# EAGLE design TimearcSides (EAGLE 6.5.0)
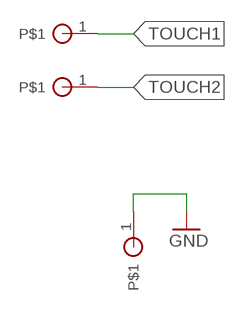
[diagram p0: schematic, sheet 1]

## Parts
TOUCH1  SOLDER_PAD  [SOLDER_PAD]
TOUCH2  SOLDER_PAD  [SOLDER_PAD]
U$3  SOLDER_PAD  [SOLDER_PAD]

## Nets
GND: U$3.1
TOUCH1: TOUCH1.1
TOUCH2: TOUCH2.1

## Library data of the parts
TOUCH1 TOUCH2 U$3 = timearc:SOLDER_PAD

## Board
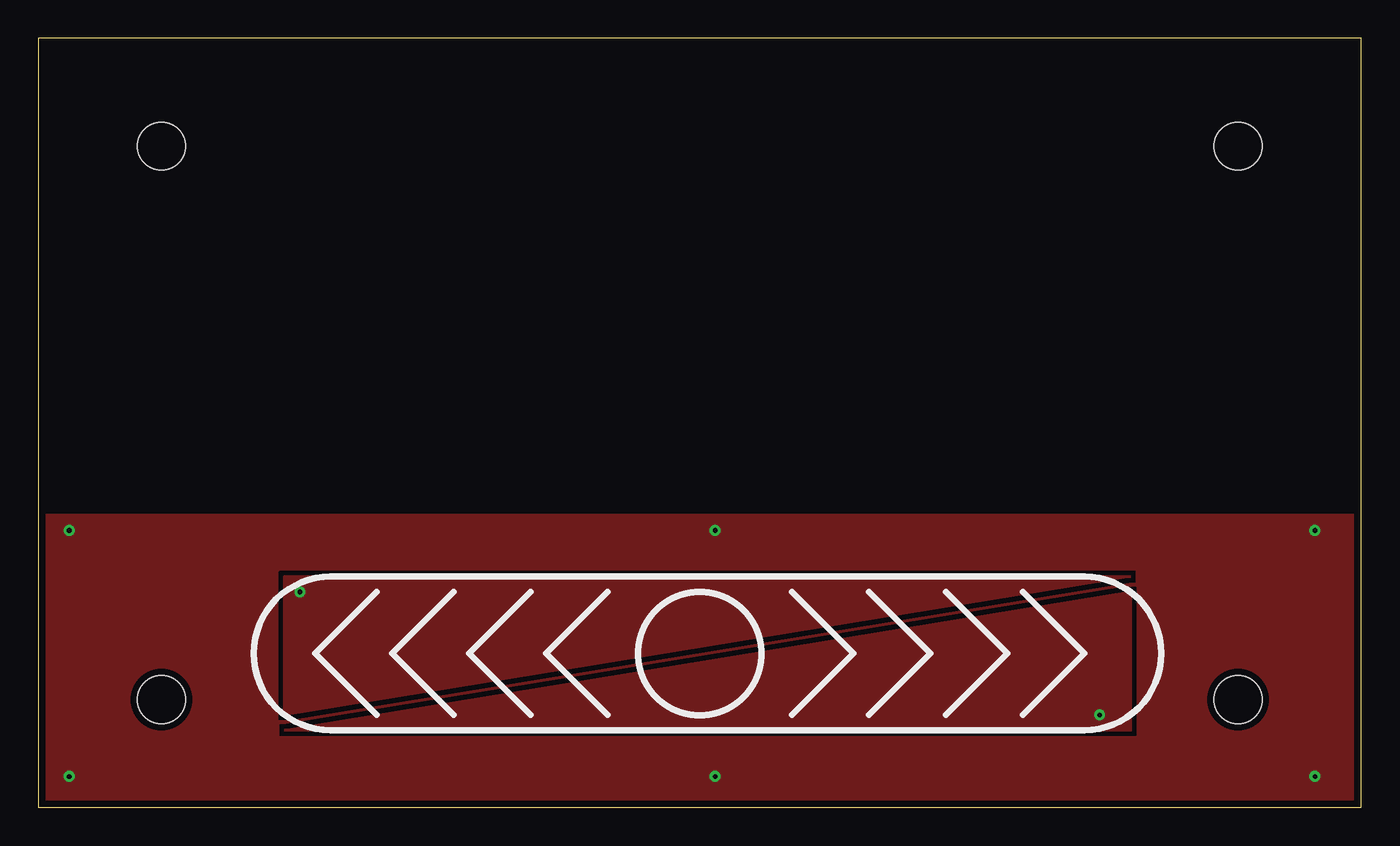
[diagram p1: board, top side]
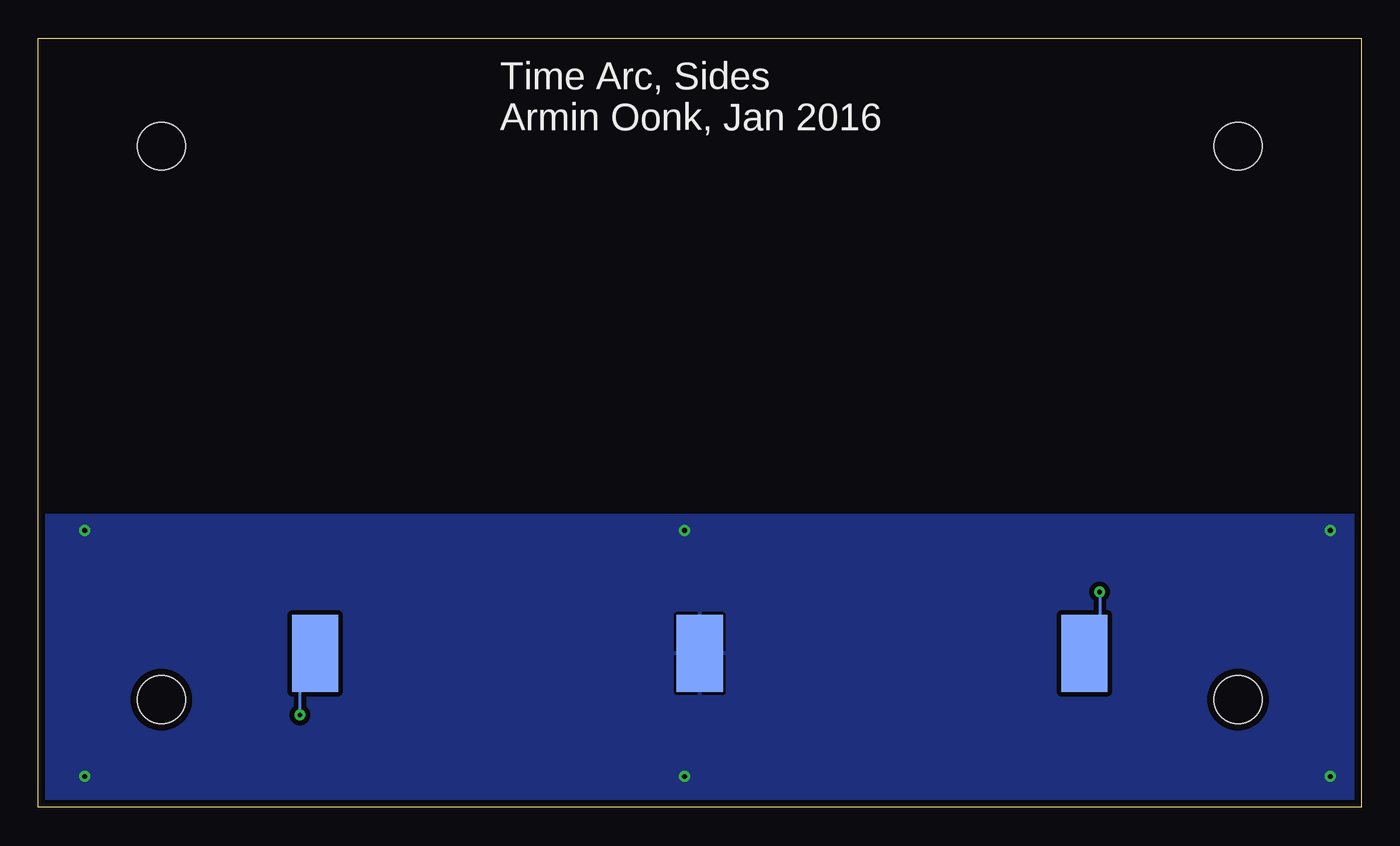
[diagram p2: board, bottom side, seen from below]

Size 86 x 50 mm. Coordinates in mm from the lower left corner, seen from the top.
Outline: 0,0 86,0 86,50 0,50 0,0
Copper layers (1*16): Top 0.018mm / dielectric 1.55mm / Bottom 0.018mm
Design rules "eC-PCB_proto-2-layer": minimum track width 0.15mm, minimum drill 0.25mm, track to track 0.15mm, track to pad 0.15mm, pad to pad 0.15mm, via to via 0.15mm, smd to smd 0.15mm, copper to edge 0.45mm, drill to drill 0.3mm, minimum pad ring 0.2mm, minimum via ring 0.2mm, stop-mask expansion 0.1mm, vias tented up to drill 0mil, thermal gap 0.2mm
Holes 3.1 mm at 8,7 8,43 78,7 78,43

### Footprints (pad centres in the part's own frame; a part is rotated, then mirrored left to right if it is on the bottom)
SOLDER_PAD = smd 3 x 5: 1 0,0

### Placement (x,y rotation side)
TOUCH1  68,10 0 bottom
TOUCH2  18,10 0 bottom
U$3  43,10 0 bottom

### Tracks (layer width: path | path; a pad name or v marks a point on that pad's centre or on a via)
GND  (via drill 0.31)
  other vias: 44,18 44,2 83,2 83,18 2,2 2,18
  pour Bottom (isolate 0.305): 0,0 86,0 86,19 0,19
  pour Top (isolate 0.305, rank 2): 0,0 0,19 86,19 86,0
TOUCH1  (via drill 0.31)
  Bottom 0.203: v69,6 69,9 TOUCH1.1
  pour Top (isolate 0.305): 71,14 71,5 16,5
TOUCH2  (via drill 0.31)
  Bottom 0.203: v17,14 17,11 TOUCH2.1
  pour Top (isolate 0.305): 16,6 16,15 71,15

### Text on the board
bNames: Time Arc, Sides / Armin Oonk, Jan 2016